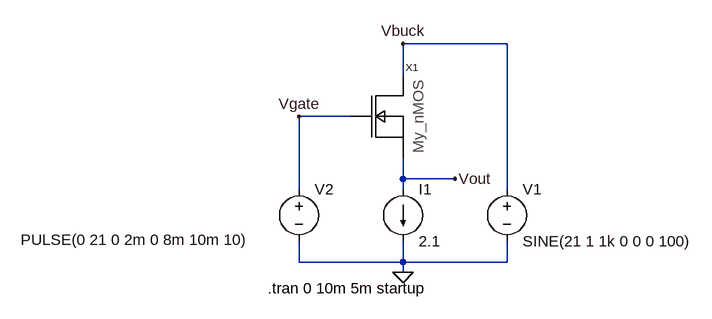
[diagram p0: schematic My_nMOS_test_current.asc]
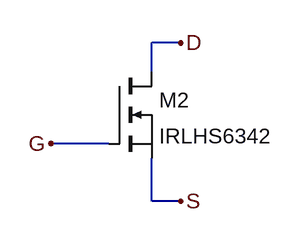
[diagram p1: sub-circuit my_nmos.asc]
My_nMOS_test_current.asc, the LTspice schematic file:
Version 4
SHEET 1 1040 680
WIRE 368 -80 208 -80
WIRE 208 -32 208 -80
WIRE 128 32 48 32
WIRE 208 128 208 96
WIRE 288 128 208 128
WIRE 48 144 48 32
WIRE 208 144 208 128
WIRE 368 144 368 -80
WIRE 48 256 48 224
WIRE 208 256 208 224
WIRE 208 256 48 256
WIRE 368 256 368 224
WIRE 368 256 208 256
WIRE 208 272 208 256
FLAG 208 272 0
FLAG 288 128 Vout
FLAG 208 -80 Vbuck
FLAG 48 32 Vgate
SYMBOL My_NMOS 224 32 R0
SYMATTR InstName X1
SYMBOL current 208 144 R0
WINDOW 123 0 0 Left 0
WINDOW 39 0 0 Left 0
SYMATTR InstName I1
SYMATTR Value 2.1
SYMBOL voltage 368 128 R0
WINDOW 123 0 0 Left 0
WINDOW 39 0 0 Left 0
SYMATTR InstName V1
SYMATTR Value SINE(21 1 1k 0 0 0 100)
SYMBOL voltage 48 128 R0
WINDOW 3 -428 94 Left 2
WINDOW 123 0 0 Left 0
WINDOW 39 0 0 Left 0
SYMATTR InstName V2
SYMATTR Value PULSE(0 21 0 2m 0 8m 10m 10)
TEXT 0 296 Left 2 !.tran 0 10m 5m startup

my_nmos.asc, the sub-circuit schematic file:
Version 4
SHEET 1 1040 680
WIRE 192 -96 160 -96
WIRE 160 -64 160 -96
WIRE 112 16 48 16
WIRE 160 80 160 32
WIRE 192 80 160 80
FLAG 192 -96 D
FLAG 192 80 S
FLAG 48 16 G
SYMBOL nmos 112 -64 R0
SYMATTR InstName M2
SYMATTR Value IRLHS6342

The netlist it stands for:
* My_nMOS_test_current.asc
XX1 Vgate Vbuck Vout my_nmos
I1 Vout 0 2.1
V1 Vbuck 0 SINE(21 1 1k 0 0 0 100)
V2 Vgate 0 PULSE(0 21 0 2m 0 8m 10m 10)

* block symbol definitions
.subckt my_nmos G D S
M2 D G S S IRLHS6342
.ends my_nmos

.model NMOS NMOS
.model PMOS PMOS
.lib standard.mos
.tran 0 10m 5m startup
.backanno
.end